# Altium schematic sheet Power.SchDoc
size A2; SheetNumber: 3; SheetTotal: 4
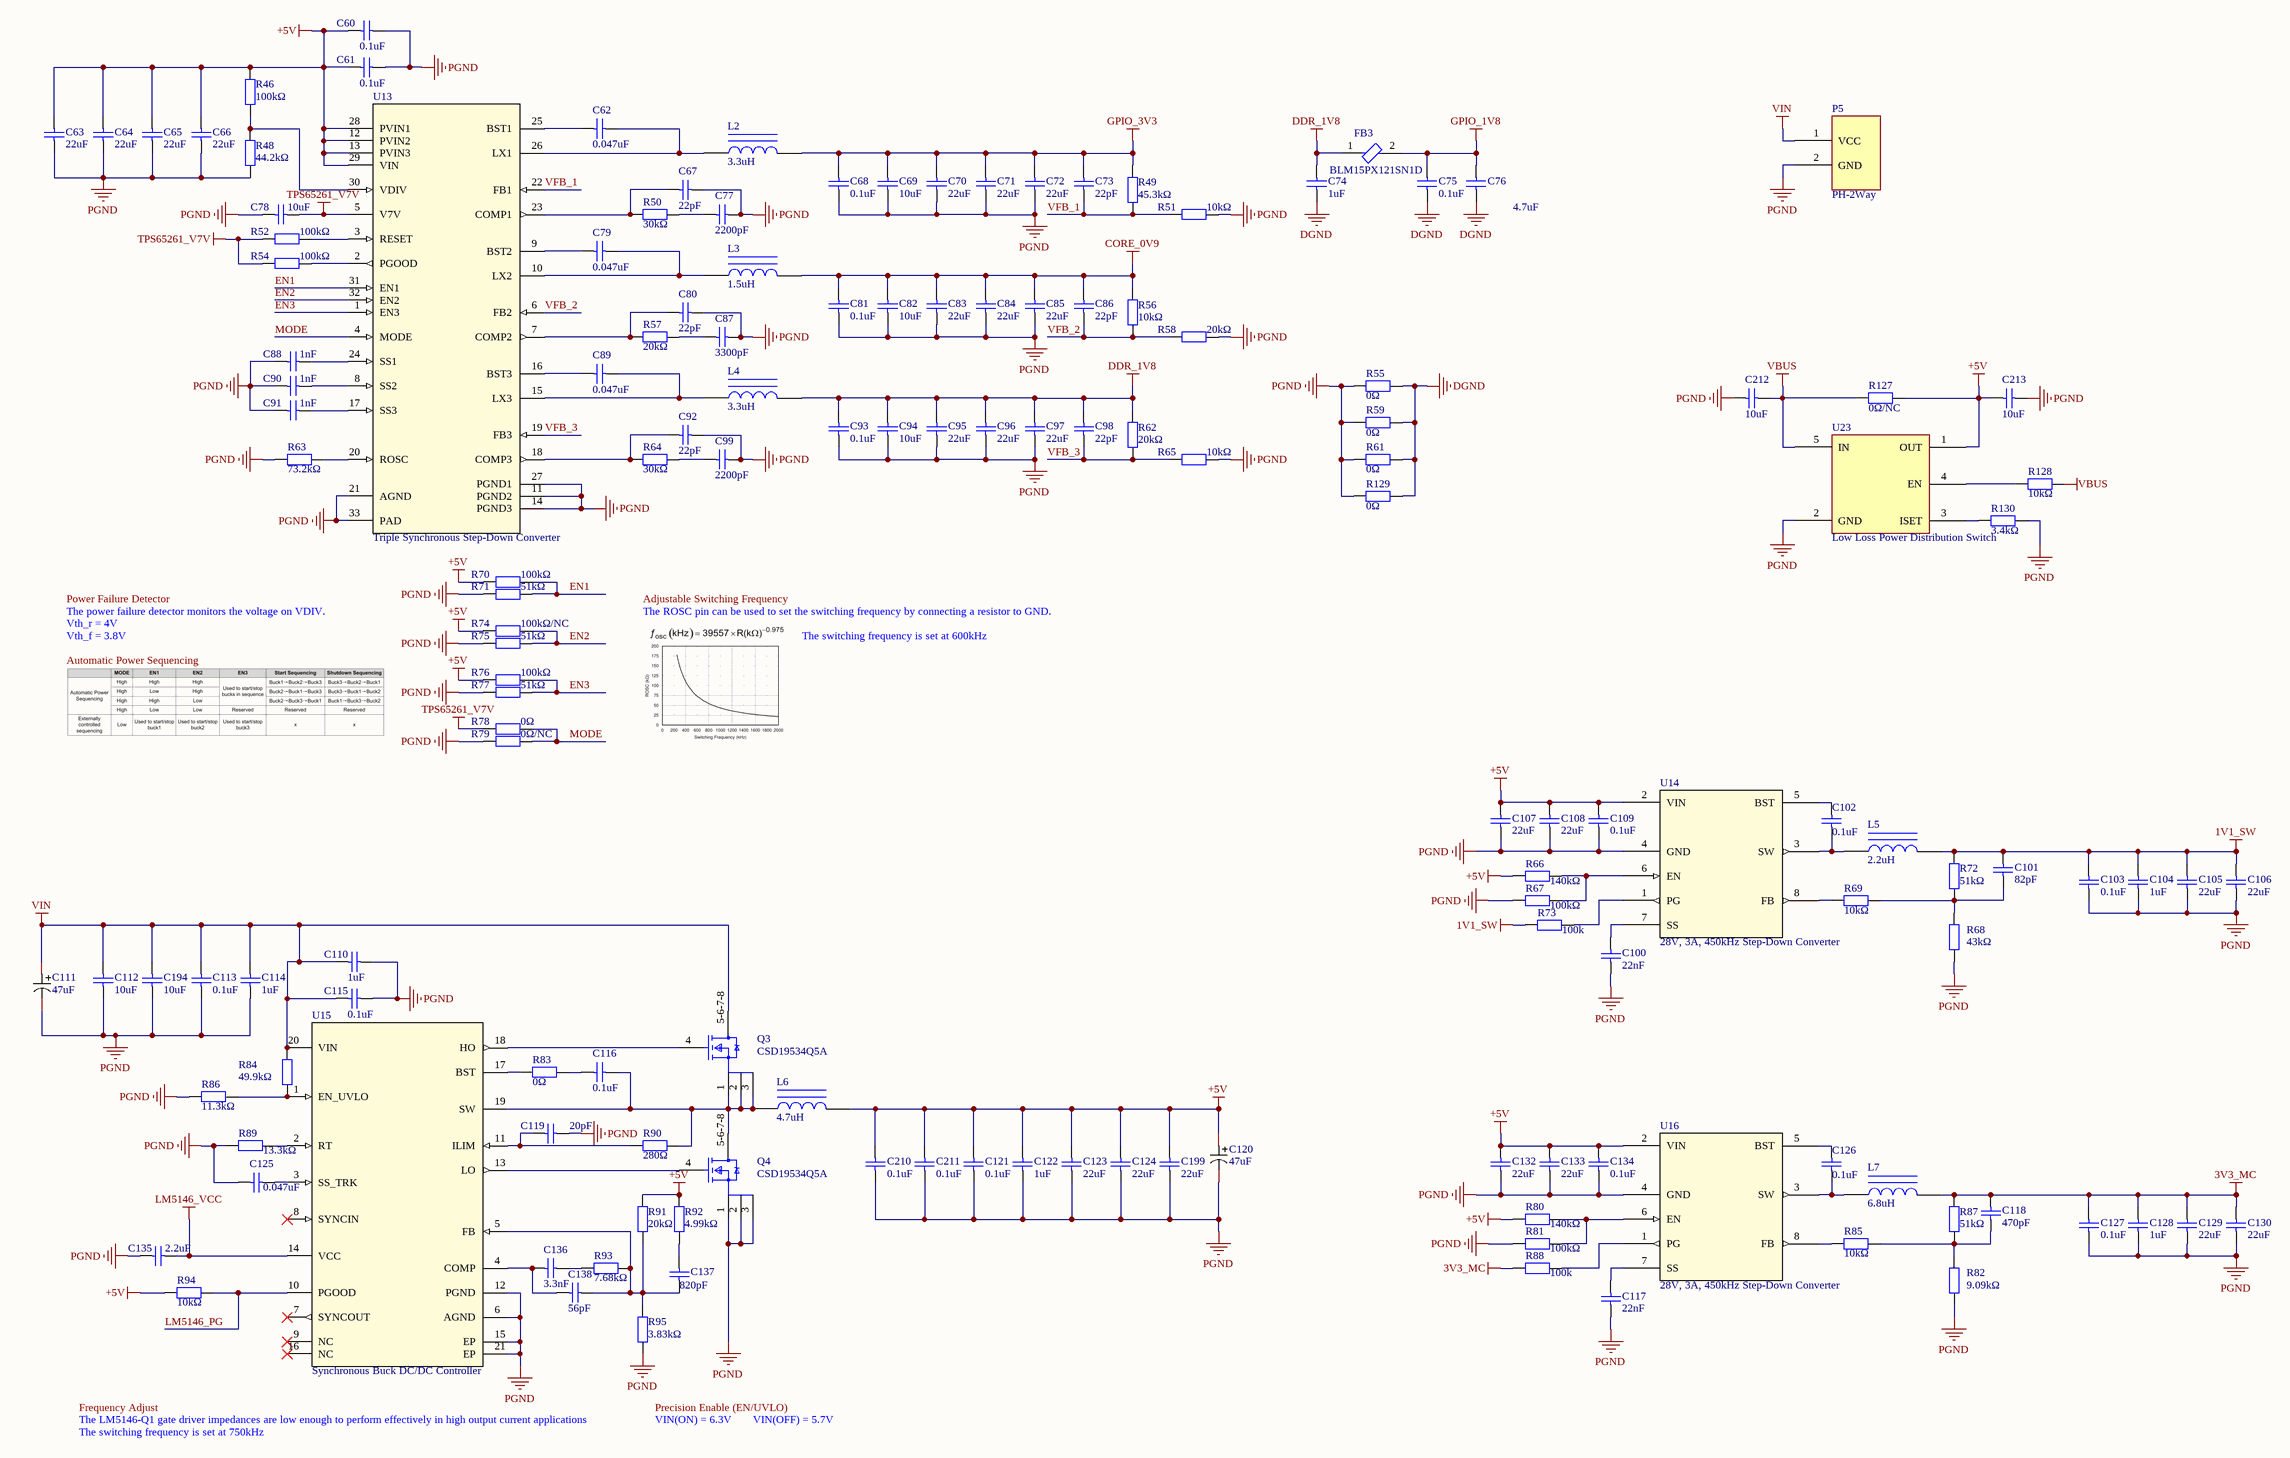
[diagram p0: Power.SchDoc]

## Parts
C60  0.1uF  [0603_C]
C61  0.1uF  [0603_C]
C62  0.047uF  [0402_C]
C63  22uF  [1206_C]
C64  22uF  [1206_C]
C65  22uF  [1206_C]
C66  22uF  [1206_C]
C67  22pF  [0402_C]
C68  0.1uF  [0603_C]
C69  10uF  [0603_C]
C70  22uF  [1206_C]
C71  22uF  [1206_C]
C72  22uF  [1206_C]
C73  22pF  [0402_C]
C74  1uF  [0402_C]
C75  0.1uF  [0402_C]
C76  4.7uF  [0402_C]
C77  2200pF  [0402_C]
C78  10uF  [0603_C]
C79  0.047uF  [0402_C]
C80  22pF  [0402_C]
C81  0.1uF  [0603_C]
C82  10uF  [0603_C]
C83  22uF  [1206_C]
C84  22uF  [1206_C]
C85  22uF  [1206_C]
C86  22pF  [0402_C]
C87  3300pF  [0402_C]
C88  1nF  [0402_C]
C89  0.047uF  [0402_C]
C90  1nF  [0402_C]
C91  1nF  [0402_C]
C92  22pF  [0402_C]
C93  0.1uF  [0603_C]
C94  10uF  [0603_C]
C95  22uF  [1206_C]
C96  22uF  [1206_C]
C97  22uF  [1206_C]
C98  22pF  [0402_C]
C99  2200pF  [0402_C]
C100  22nF  [0402_C]
C101  82pF  [0402_C]
C102  0.1uF  [0603_C]
C103  0.1uF  [0603_C]
C104  1uF  [0603_C]
C105  22uF  [1206_C]
C106  22uF  [1206_C]
C107  22uF  [1206_C]
C108  22uF  [1206_C]
C109  0.1uF  [0603_C]
C110  1uF  [0402_C]
C111  47uF  [CM D(6.3*5.4)]
C112  10uF  [0603_C]
C113  0.1uF  [0603_C]
C114  1uF  [0603_C]
C115  0.1uF  [0402_C]
C116  0.1uF  [0402_C]
C117  22nF  [0402_C]
C118  470pF  [0402_C]
C119  20pF  [0402_C]
C120  47uF  [CM D(6.3*5.4)]
C121  0.1uF  [0603_C]
C122  1uF  [0603_C]
C123  22uF  [1206_C]
C124  22uF  [1206_C]
C125  0.047uF  [0402_C]
C126  0.1uF  [0603_C]
C127  0.1uF  [0603_C]
C128  1uF  [0603_C]
C129  22uF  [1206_C]
C130  22uF  [1206_C]
C132  22uF  [1206_C]
C133  22uF  [1206_C]
C134  0.1uF  [0603_C]
C135  2.2uF  [0805_C]
C136  3.3nF  [0402_C]
C137  820pF  [0402_C]
C138  56pF  [0402_C]
C194  10uF  [0603_C]
C199  22uF  [1206_C]
C210  0.1uF  [0603_C]
C211  0.1uF  [0603_C]
C212  10uF  [1206_C]
C213  10uF  [1206_C]
FB3  BLM15PX121SN1D  [FP-BLM15-0_05-d0_7-MFG]
L2  3.3uH  [FTC_3030]
L3  1.5uH  [FTC_3030]
L4  3.3uH  [FTC_3030]
L5  2.2uH  [FTC_3030]
L6  4.7uH  [INDM113101X40N]
L7  6.8uH  [FTC_3030]
P5  PH-2Way  [XT30-F]
Q3  CSD19534Q5A  [FP-DQJ0008A-MFG]
Q4  CSD19534Q5A  [FP-DQJ0008A-MFG]
R46  100kΩ  [0402_R]
R48  44.2kΩ  [0402_R]
R49  45.3kΩ  [0402_R]
R50  30kΩ  [0402_R]
R51  10kΩ  [0402_R]
R52  100kΩ  [0402_R]
R54  100kΩ  [0402_R]
R55  0Ω  [1206_R]
R56  10kΩ  [0402_R]
R57  20kΩ  [0402_R]
R58  20kΩ  [0402_R]
R59  0Ω  [1206_R]
R61  0Ω  [1206_R]
R62  20kΩ  [0402_R]
R63  73.2kΩ  [0402_R]
R64  30kΩ  [0402_R]
R65  10kΩ  [0402_R]
R66  140kΩ  [0402_R]
R67  100kΩ  [0402_R]
R68  43kΩ  [0402_R]
R69  10kΩ  [0402_R]
R70  100kΩ  [0402_R]
R71  51kΩ  [0402_R]
R72  51kΩ  [0402_R]
R73  100k  [0402_R]
R74  100kΩ/NC  [0402_R]
R75  51kΩ  [0402_R]
R76  100kΩ  [0402_R]
R77  51kΩ  [0402_R]
R78  0Ω  [0402_R]
R79  0Ω/NC  [0402_R]
R80  140kΩ  [0402_R]
R81  100kΩ  [0402_R]
R82  9.09kΩ  [0402_R]
R83  0Ω  [0402_R]
R84  49.9kΩ  [0402_R]
R85  10kΩ  [0402_R]
R86  11.3kΩ  [0402_R]
R87  51kΩ  [0402_R]
R88  100k  [0402_R]
R89  13.3kΩ  [0402_R]
R90  280Ω  [0402_R]
R91  20kΩ  [0402_R]
R92  4.99kΩ  [0402_R]
R93  7.68kΩ  [0402_R]
R94  10kΩ  [0402_R]
R95  3.83kΩ  [0402_R]
R127  0Ω/NC  [1206_R]
R128  10kΩ  [0603_R]
R129  0Ω  [1206_R]
R130  3.4kΩ  [0603_R]
U13  Triple Synchronous Step-Down Converter  [QFN50P500X500X100_HS-33N]
U14  28V, 3A, 450kHz Step-Down Converter  [SOT583_MP2338_MNP]
U15  Synchronous Buck DC/DC Controller  [RGY0020B]
U16  28V, 3A, 450kHz Step-Down Converter  [SOT583_MP2338_MNP]
U23  Low Loss Power Distribution Switch  [SOT95P285X130-5N]

## Nets
1V1_SW: C101.2 C103.2 C104.2 C105.2 C106.2 L5.2 R72.2 R73.1
3V3_MC: C118.2 C127.2 C128.2 C129.2 C130.2 L7.2 R87.2 R88.1
+5V: C60.2 C61.2 C63.2 C64.2 C65.2 C66.2 C107.2 C108.2 C109.2 C120.1 C121.2 C122.2 C123.2 C124.2 C132.2 C133.2 C134.2 C199.2 C210.2 C211.2 C213.1 L6.2 R46.2 R66.2 R70.1 R74.1 R76.1 R80.2 R91.2 R92.2 R94.2 R127.2 U13.12(PVIN2) U13.13(PVIN3) U13.28(PVIN1) U13.29(VIN) U14.2(VIN) U16.2(VIN) U23.1(OUT)
CORE_0V9: C81.2 C82.2 C83.2 C84.2 C85.2 C86.2 L3.2 R56.2
DDR_1V8: C74.2 C93.2 C94.2 C95.2 C96.2 C97.2 C98.2 FB3.1 L4.2 R62.2
DGND: C74.1 C75.1 C76.1 R55.2 R59.2 R61.2 R129.2
GPIO_1V8: C75.2 C76.2 FB3.2
GPIO_3V3: C68.2 C69.2 C70.2 C71.2 C72.2 C73.2 L2.2 R49.2
LM5146_VCC: C135.1 U15.14(VCC)
PGND: C60.1 C61.1 C63.1 C64.1 C65.1 C66.1 C67.2 C68.1 C69.1 C70.1 C71.1 C72.1 C77.2 C78.1 C80.2 C81.1 C82.1 C83.1 C84.1 C85.1 C87.2 C88.1 C90.1 C91.1 C92.2 C93.1 C94.1 C95.1 C96.1 C97.1 C99.2 C100.1 C103.1 C104.1 C105.1 C106.1 C107.1 C108.1 C109.1 C110.1 C111.2 C112.2 C113.2 C114.2 C115.1 C117.2 C119.2 C120.2 C121.1 C122.1 C123.1 C124.1 C125.2 C127.1 C128.1 C129.1 C130.1 C132.1 C133.1 C134.1 C135.2 C194.2 C199.1 C210.1 C211.1 C212.2 C213.2 P5.2(GND) Q4.1(S) Q4.2(S) Q4.3(S) R48.1 R51.1 R55.1 R58.1 R59.1 R61.1 R63.1 R65.1 R67.2 R68.1 R71.2 R75.2 R77.2 R79.2 R81.2 R82.1 R86.2 R89.2 R95.1 R129.1 R130.1 U13.11(PGND2) U13.14(PGND3) U13.21(AGND) U13.27(PGND1) U13.33(PAD) U14.4(GND) U15.6(AGND) U15.12(PGND) U15.15(EP) U15.21(EP) U16.4(GND) U23.2(GND)
TPS65261_V7V: C78.2 R52.1 R54.1 R78.2 U13.5(V7V)
VBUS: C212.1 R127.1 R128.2 U23.5(IN)
VIN: C110.2 C111.1 C112.1 C113.1 C114.1 C115.2 C194.1 P5.1(VCC) Q3.5-6-7-8(D) R84.2 U15.20(VIN)
EN1: R70.2 R71.1 U13.31(EN1)
EN2: R74.2 R75.1 U13.32(EN2)
EN3: R76.2 R77.1 U13.1(EN3)
LM5146_PG: R94.1 U15.10(PGOOD)
MODE: R78.1 R79.1 U13.4(MODE)
VFB_1: C73.1 R49.1 R51.2 U13.22(FB1)
VFB_2: C86.1 R56.1 R58.2 U13.6(FB2)
VFB_3: C98.1 R62.1 R65.2 U13.19(FB3)
NetC62_1: C62.1 U13.25(BST1)
NetC62_2: C62.2 L2.1 U13.26(LX1)
NetC67_1: C67.1 R50.1 U13.23(COMP1)
NetC77_1: C77.1 R50.2
NetC79_1: C79.1 U13.9(BST2)
NetC79_2: C79.2 L3.1 U13.10(LX2)
NetC80_1: C80.1 R57.1 U13.7(COMP2)
NetC87_1: C87.1 R57.2
NetC88_2: C88.2 U13.24(SS1)
NetC89_1: C89.1 U13.16(BST3)
NetC89_2: C89.2 L4.1 U13.15(LX3)
NetC90_2: C90.2 U13.8(SS2)
NetC91_2: C91.2 U13.17(SS3)
NetC92_1: C92.1 R64.1 U13.18(COMP3)
NetC99_1: C99.1 R64.2
NetC100_2: C100.2 U14.7(SS)
NetC101_1: C101.1 R68.2 R69.1 R72.1
NetC102_1: C102.1 L5.1 U14.3(SW)
NetC102_2: C102.2 U14.5(BST)
NetC116_1: C116.1 R83.2
NetC116_2: C116.2 L6.1 Q3.1(S) Q3.2(S) Q3.3(S) Q4.5-6-7-8(D) R90.2 U15.19(SW)
NetC117_1: C117.1 U16.7(SS)
NetC118_1: C118.1 R82.2 R85.1 R87.1
NetC119_1: C119.1 R90.1 U15.11(ILIM)
NetC125_1: C125.1 U15.3(SS_TRK)
NetC126_1: C126.1 L7.1 U16.3(SW)
NetC126_2: C126.2 U16.5(BST)
NetC136_1: C136.1 R93.2
NetC136_2: C136.2 C138.2 U15.4(COMP)
NetC137_1: C137.1 C138.1 R91.1 R93.1 R95.2 U15.5(FB)
NetC137_2: C137.2 R92.1
NetQ3_4: Q3.4(G) U15.18(HO)
NetQ4_4: Q4.4(G) U15.13(LO)
NetR46_1: R46.1 R48.2 U13.30(VDIV)
NetR52_2: R52.2 U13.3(RESET)
NetR54_2: R54.2 U13.2(PGOOD)
NetR63_2: R63.2 U13.20(ROSC)
NetR66_1: R66.1 R67.1 U14.6(EN)
NetR69_2: R69.2 U14.8(FB)
NetR73_2: R73.2 U14.1(PG)
NetR80_1: R80.1 R81.1 U16.6(EN)
NetR83_1: R83.1 U15.17(BST)
NetR84_1: R84.1 R86.1 U15.1(EN_UVLO)
NetR85_2: R85.2 U16.8(FB)
NetR88_2: R88.2 U16.1(PG)
NetR89_1: R89.1 U15.2(RT)
NetR128_1: R128.1 U23.4(EN)
NetR130_2: R130.2 U23.3(ISET)

Not connected (* = marked no-connect by the designer): U15 7(SYNCOUT)* 8(SYNCIN)* 9(NC)* 16(NC)*

## Notes on the sheet
- Power Failure Detector
- The power failure detector monitors the voltage on VDIV.
- Vth_r = 4V
- Vth_f = 3.8V
- Adjustable Switching Frequency
- The ROSC pin can be used to set the switching frequency by connecting a resistor to GND.
- The switching frequency is set at 600kHz
- Automatic Power Sequencing
- The LM5146-Q1 gate driver impedances are low enough to perform effectively in high output current applications
- Frequency Adjust
- The switching frequency is set at 750kHz
- Precision Enable (EN/UVLO)
- VIN(ON) = 6.3V
- VIN(OFF) = 5.7V

## Library data of the parts
C60-C110 C112-C119 C121-C130 C132-C138 C194 C199 C210-C213 = SMT_Cap: 贴片电容; ComponentLink1Description: 供应商链接; ComponentLink1URL: http://www.szlcsc.com/product/details_29010.html; Package: 0805; Supplier: LC; SuppliersPartNumber: C28260
C111 C120 = SMT_Cap_Electrolytic: 贴片电容; ComponentLink1Description: 供应商链接; ComponentLink1URL: http://www.szlcsc.com/product/details_29010.html; Package: 0805; Supplier: LC; SuppliersPartNumber: C28260
FB3 = CMP-0686-00133-3: Chip Ferrite Bead, 0402, 120Ω @ 100MHz, 0.055Ω, 25%, 2A; Impedance: 120R; DC Resistance (DCR): 55mR; Number of Circuits: 1; Material: Steel; Lead Free: Lead Free; Package Quantity: 10000; Width: 0.5mm; Case Code (Metric): 1005; Test Frequency: 100MHz; Weight: 2.3E-05oz; Max DC Current: 2A; Current Rating: 2A; REACH SVHC: No SVHC; Case Code (Imperial): 0402; Min Operating Temperature: -55°C; Max Operating Temperature: 125°C; Max Current Rating: 2A; Series: EMIFIL®, BLM15P; Tolerance: 25%; Termination: SMD/SMT; Number of Lines: 1; Case/Package: 0402; RoHS Compliant: Yes; Number of Pins: 2; Length: 1mm; Height: 0.5mm; Packaging: Tape and Reel
L2-L7 = SMT_Iud_Power: 功率电感; ComponentLink1Description: 供应商链接; ComponentLink1URL: http://www.szlcsc.com/product/details_30010.html; Package: 0603; Supplier: LC; SuppliersPartNumber: C29258
Q3 Q4 = CMP-04962-000018-1: MOSFET N-CH 100V 50 8SON; Manufacturer: Texas Instruments; Reverse Recovery Time: 53ns; Turn Off Delay Time: 20ns; Gate To Source Voltage: 20V; Turn On Delay Time: 9ns; Depletion Mode: False; Threshold Vgs Max: 3.4V; Pulse Drain Current: 137A; Number Of N Channels: 1; Input Capacitace At Vds: 1290pF @ 50V; Max Junction Temp: +150°C; Power Dissipation: 3.2W; Max Forward Diode Voltage: 1V; Continuous Drain Current: 10A; Drain To Source Resistance: 12.6mΩ; Threshold Vgs Min: 2.4V; Transconductance: 47S; Gate Charge At Vgs: 17nC @ 10V; Reverse Recovery Charge: 134nC; Typ Forward Diode Voltage: 0.8V; Rthja Max: 50°C/W; Drain To Source Breakdown Voltage: 100V; Device Class L2: Transistors; Height: 1.1mm; Temperature Range Low: -55°C; Temperature Range High: +150°C; Temperature: -55°C to +150°C; Device Class L1: Discrete Semiconductors; ComponentLink2Description: Datasheet; Number Of Channels: 1; Lead Free: Yes; Octopart: https://octopart.com/csd19534q5a-texas+instruments-46749514; Package: DQJ0008A; Category: Trans; Mouser Description: MOSFET N-Channel MOSFET; Device Class L3: MOSFETs; Digikey Description: MOSFET N-CH 100V 50 8SON; Drain To Source Voltage: 100V; Automotive: No; ComponentLink2URL: http://www.ti.com/lit/ds/symlink/csd19534q5a.pdf; RoHS: TRUE; Manufacturer Part Number: CSD19534Q5A
R46 R48-R52 R54-R59 R61-R95 R127-R130 = SMT_Res: 贴片电阻; ComponentLink1Description: 供应商链接; ComponentLink1URL: http://www.szlcsc.com/product/details_23980.html; Package: 0603; Supplier: LC; SuppliersPartNumber: C23253
U13 = TPS65261RHBR: The TPS65261, TPS65261-1 is a monolithic triple / synchronous step-down (buck) converter with 3- / A/2-A/2-A output currents. A wide 4.5-V to 18- / V input supply voltage range encompasses the / most intermediate bus voltages operating off 5- / V, 9-V, 12-V or 15-V power bus.; Mfr_Name: Texas Instruments; Alternate_Manufacturer: None; CurrentTime: Not shown in title block; DocumentNumber: 1; SymbolCreator: a0411947; CompType: IC; U/M: EA; Designator: U?; CurrentDate: Not shown in title block; Time: Not shown in title block; Date: Not shown in title block; DocumentFullPathAndName: Not shown in title block; DocumentName: Not shown in title block; ModifiedDate: Not shown in title block; ApprovedBy: Not shown in title block; CheckedBy: Not shown in title block; Author: Not shown in title block; CompanyName: Not shown in title block; Engineer: Not shown in title block; Organization: Not shown in title block; Address1: Not shown in title block; Address2: Not shown in title block; Address3: Not shown in title block; Address4: Not shown in title block; Revision: Use project parameter SCH_Rev; SheetNumber: 1; SheetTotal: 1; ImagePath: Not shown in title block; Rule: *; ProjectName: *; SymbolVersion: 2014-02-22; PartNumber: TPS65261RHB; PackageReference: RHB0032E; MountType: SMT; ComponentLink1Description: Datasheet Link; ComponentLink1URL: http://www.ti.com/lit/ds/symlink/tps65261.pdf; RoHS: Y; Publisher: Texas Instruments; LatestRevisionDate: 2014-04-14; Manufacturer: Texas Instruments; RefDes: Refdes; Type: Type
U14 U16 = MP2338GTL-P: High-Efficiency, 28V, 3A, 450kHz, / Synchronous Step-Down Converter / In SOT583 Package; Mfr_Name: Monolithic Power Systems; RefDes: RefDes; Type: Type
U15 = LM5146QRGYRQ1: The LM5146 100-V synchronous buck controller / regulates from a high input voltage source or from an / input rail subject to high-voltage transients, minimizing / the need for external surge suppression components.; Mfr_Name: Texas Instruments; TYPE: TYPE; RefDes: RefDes
U23 = SY6280: The SY6280 develops ultra-low Rds(on) switch with / programmable current limiting to protect the power / source from over current and short circuit conditions.